# EAGLE design 25_UBX_test (EAGLE 9.0.0)
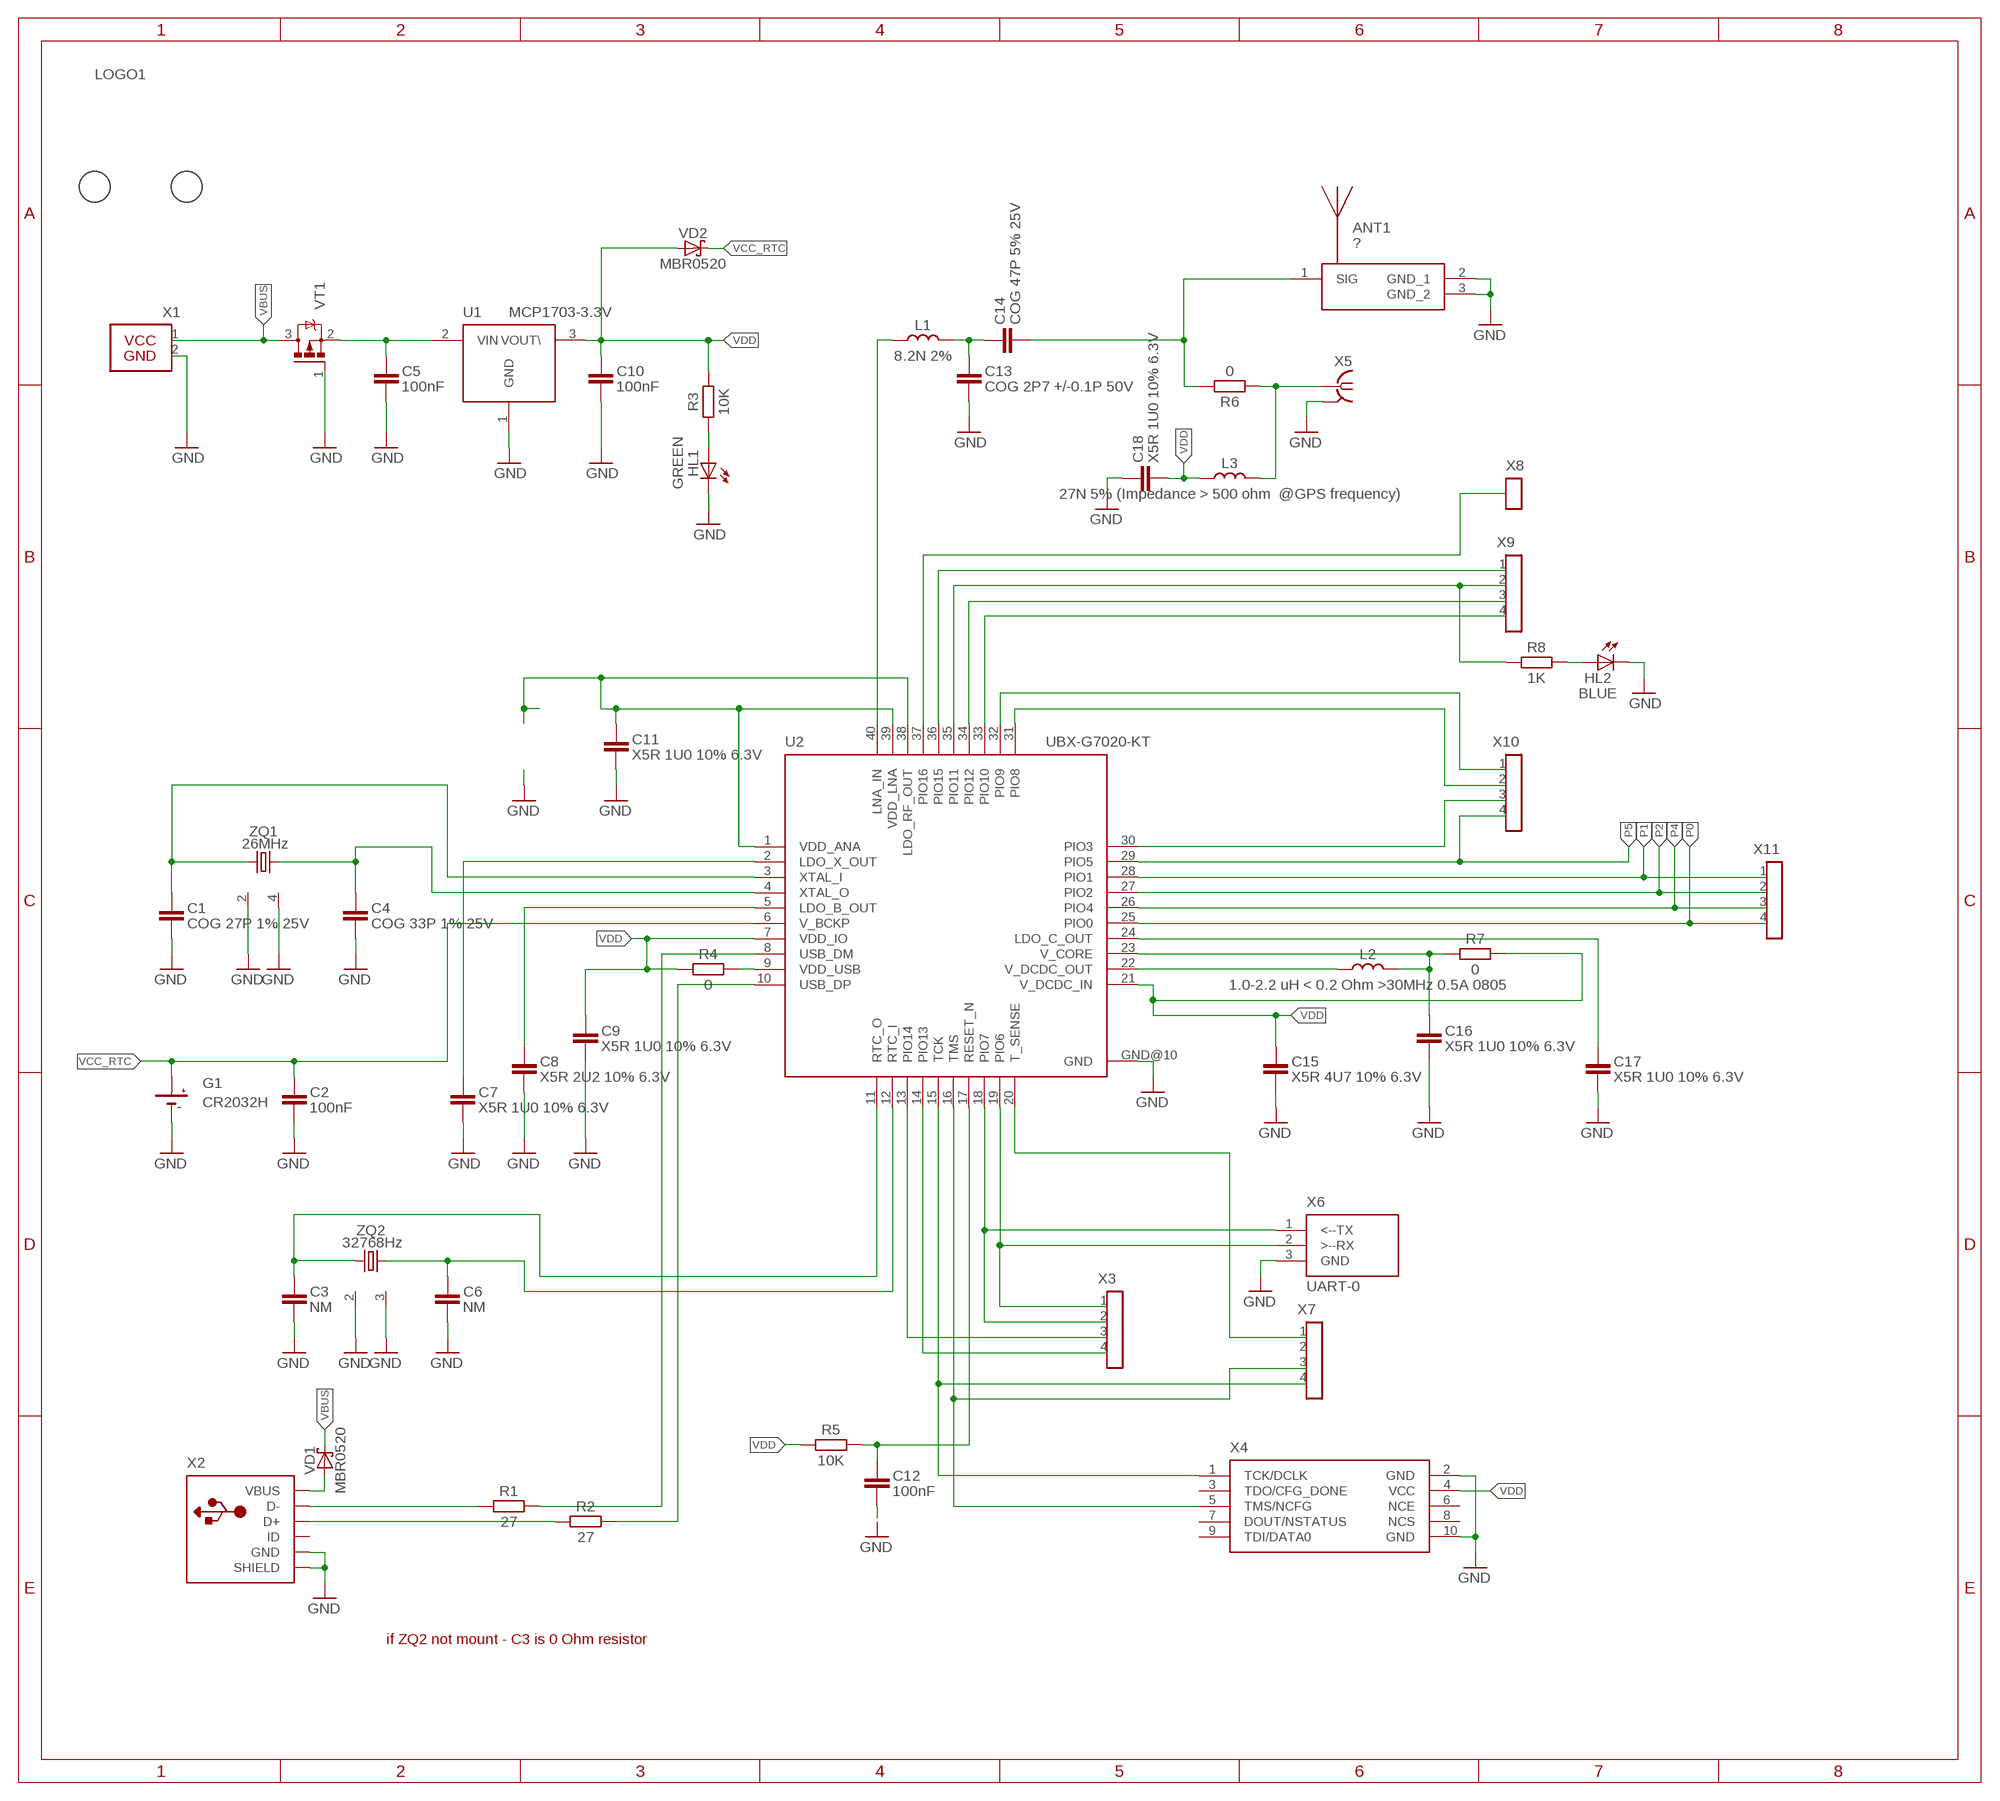
[diagram p0: schematic, sheet 1]

## Parts
ANT1  ?  ANT-GPS-3  [ANTENNA-GPS-AMAN1003030ST01]
C1  COG 27P 1% 25V  C-EU-C0603  [C0603]
C2  100nF  C-EU-C0603  [C0603]
C3  NM  C-EU-C0402  [C0402]
C4  COG 33P 1% 25V  C-EU-C0603  [C0603]
C5  100nF  C-EU-C0805  [C0805]
C6  NM  C-EU-C0402  [C0402]
C7  X5R 1U0 10% 6.3V  C-EU-C0603  [C0603]
C8  X5R 2U2 10% 6.3V  C-EU-C0603  [C0603]
C9  X5R 1U0 10% 6.3V  C-EU-C0603  [C0603]
C10  100nF  C-EU-C1206  [C1206]
C11  X5R 1U0 10% 6.3V  C-EU-C0603  [C0603]
C12  100nF  C-EU-C0603  [C0603]
C13  COG 2P7 +/-0.1P 50V  C-EU-C0603  [C0603]
C14  COG 47P 5% 25V  C-EU-C0603  [C0603]
C15  X5R 4U7 10% 6.3V  C-EU-C0603  [C0603]
C16  X5R 1U0 10% 6.3V  C-EU-C0603  [C0603]
C17  X5R 1U0 10% 6.3V  C-EU-C0603  [C0603]
C18  X5R 1U0 10% 6.3V  C-EU-C0603  [C0603]
FIDUCIAL1  FIDUCIAL-1MM  [FIDUCIAL_1MM]
FIDUCIAL2  FIDUCIAL-1MM  [FIDUCIAL_1MM]
G1  CR2032H  [SN2032]
HL1  GREEN  LED0805  [CHIPLED_0805]
HL2  BLUE  LED0805  [CHIPLED_0805]
L1  8.2N 2%  LL0603  [L0603-1]
L2  1.0-2.2 uH < 0.2 Ohm >30MHz 0.5A 0805  LL0805  [L0805]
L3  27N 5% (Impedance > 500 ohm @GPS frequency)  LL0603  [L0603-1]
LOGO1  LOGO6  [LOGO_OMEGA]
R1  27  R-EU0603  [R0603]
R2  27  R-EU0603  [R0603]
R3  10K  R-EU0603  [R0603]
R4  0  R-EU0805  [R0805]
R5  10K  R-EU0603  [R0603]
R6  0  R-EU0603  [R0603]
R7  0  R-EU0603  [R0603]
R8  1K  R-EU0603  [R0603]
U1  MCP1703-3.3V  MCP170XSOT89  [SOT89]
U2  UBX-G7020-KT  [QFN40-5X5]
VD1  MBR0520  SCHOTTKY-DIODE-SOD123  [SOD123]
VD2  MBR0520  SCHOTTKY-DIODE-SOD123  [SOD123]
VT1  FET_P-SOT23  [SOT23-3-1]
X1  CON-2P-1  [PLS-2.54-2]
X2  USB-5S-MINI  [USB-MINIB-1]
X3  CON-4PPLS2-4  [PLS2-4]
X4  JTAG-ALTERA-5X2PINHEAD  [ML10_NEW]
X5  U.FL-2  [U.FL.-4PIN]
X6  UART-0  [PLS-2.54-3]
X7  CON-4PPLS2-4  [PLS2-4]
X8  CON-1PPLS2-1  [PLS2-1]
X9  CON-4PPLS2-4  [PLS2-4]
X10  CON-4PPLS2-4  [PLS2-4]
X11  CON-4PPLS2-4  [PLS2-4]
ZQ1  26MHz  REZONATOR-4PIN-3225  [CRYSTAL-SMD-3225]
ZQ2  32768Hz  REZONATOR-4PIN-SJK-7M  [SJK-7M]

## Nets
ANT: ANT1.1(SIG) C14.2 R6.1
D_N: R1.1 U2.8(USB_DM)
D_P: R2.1 U2.10(USB_DP)
GND: ANT1.2(GND_1) ANT1.3(GND_2) C1.2 C2.2 C3.2 C4.2 C5.2 C6.2 C7.2 C8.2 C9.2 C10.2 C11.2 C12.2 C13.2 C15.2 C16.2 C17.2 C18.1 G1.-BATT(-) HL1.C HL2.C U1.1(GND) U2.GND@10(GND) VT1.1(G) X1.2 X2.GND X2.SHIELD@1(SHIELD) X2.SHIELD@2(SHIELD) X2.SHIELD@3(SHIELD) X2.SHIELD@4(SHIELD) X4.2(GND) X4.10(GND) X5.S@1(GND) X5.S@2(GND) X5.S@3(GND) X6.3(GND) ZQ1.2(S) ZQ1.4(S) ZQ2.2(S) ZQ2.3(S)
N$1: VD1.A X2.VBUS
N$2: L3.1(%1) R6.2 X5.1
N$4: HL1.A R3.1
N$5: C8.1 U2.5(LDO_B_OUT)
N$6: C17.1 U2.24(LDO_C_OUT)
N$7: L1.1(%1) U2.40(LNA_IN)
N$8: C13.1 C14.1 L1.2(%2)
N$9: R1.2 X2.D-
N$10: R2.2 X2.D+
N$12: C7.1 U2.2(LDO_X_OUT)
N$13: C11.1 U2.1(VDD_ANA) U2.38(LDO_RF_OUT) U2.39(VDD_LNA)
N$27: C5.1 U1.2(VIN) VT1.2(S)
N$32: HL2.A R8.2
N$37: R4.1 U2.9(VDD_USB)
N$38: L2.1(%1) U2.22(V_DCDC_OUT)
N$39: C16.1 L2.2(%2) R7.1 U2.23(V_CORE)
P0: U2.25(PIO0) X11.4
P1: U2.28(PIO1) X11.1
P2: U2.27(PIO2) X11.2
P3: U2.30(PIO3) X10.3
P4: U2.26(PIO4) X11.3
P5: U2.29(PIO5) X10.4
P6: U2.19(PIO6) X3.1 X6.2(>--RX)
P7: U2.18(PIO7) X3.2 X6.1(<--TX)
P8: U2.31(PIO8) X10.2
P9: U2.32(PIO9) X10.1
P10: U2.33(PIO10) X9.4
P11: R8.1 U2.35(PIO11) X9.2
P12: U2.34(PIO12) X9.3
P13: U2.14(PIO13) X3.4
P14: U2.13(PIO14) X3.3
P15: U2.36(PIO15) X9.1
P16: U2.37(PIO16) X8.1
RES: C12.1 R5.2 U2.17(RESET_N)
RTCI: C6.1 U2.12(RTC_I) ZQ2.4
RTCO: C3.1 U2.11(RTC_O) ZQ2.1
T_SENSE: U2.20(T_SENSE) X7.1
TCK: U2.15(TCK) X4.1(TCK/DCLK) X7.4
TMS: U2.16(TMS) X4.5(TMS/NCFG) X7.3
VBUS: VD1.C VT1.3(D) X1.1
VCC_RTC: C2.1 G1.+BATT(+) U2.6(V_BCKP) VD2.C
VDD: C9.1 C10.1 C15.1 C18.2 L3.2(%2) R3.2 R4.2 R5.1 R7.2 U1.3(VOUT\) U2.7(VDD_IO) U2.21(V_DCDC_IN) VD2.A X4.4(VCC)
XTALI: C1.1 U2.3(XTAL_I) ZQ1.1
XTALO: C4.1 U2.4(XTAL_O) ZQ1.3
Unconnected: X2.ID X4.3(TDO/CFG_DONE) X4.6(NCE) X4.7(DOUT/NSTATUS) X4.8(NCS) X4.9(TDI/DATA0) X7.2

## Notes on the sheet
- VCC
- GND
- if ZQ2 not mount - C3 is 0 Ohm resistor

## Library data of the parts
ANT1 = !ht3_misc:ANT-GPS-3
C1-C18 = !ht3_passive:C-EU: CAPACITOR, European symbol
FIDUCIAL1 FIDUCIAL2 = !ht3_misc:FIDUCIAL: For use by pick and place machines to calibrate the vision/machine, 1mm By microbuilder.eu
G1 = !ht3_misc:CR2032H: LI BATTERY Varta
HL1 HL2 = !ht3_leds:LED: LED OSRAM: - CHIPLED LG R971, LG N971, LY N971, LG Q971, LY Q971, LO R971, LY R971 LH N974, LH R974 LS Q976, LO Q976, LY Q976 LO Q996 - Hyper CHIPLED LW Q18S LB Q993, LB Q99A, LB R99A - SideLED LS A670, LO A670, LY A670, LG A670, LP A670 LB A673, LV A673, LT A673, LW A673 LH A674 LY A675 LS A676, LA A676, LO A676, LY A676, LW A676 LS A679, LY A679, LG A679 - Hyper Micro SIDELED® LS Y876, LA Y876, LO Y876, LY Y876 LT Y87S - SmartLED LW L88C, LW L88S LB L89C, LB L89S, LG L890 LS L89K, LO L89K, LY L89K LS L896, LA L896, LO L896, LY L896 - TOPLED LS T670, LO T670, LY T670, LG T670, LP T670 LSG T670, LSP T670, LSY T670, LOP T670, LYG T670 LG T671, LOG T671, LSG T671 LB T673, LV T673, LT T673, LW T673 LH T674 LS T676, LA T676, LO T676, LY T676, LB T676, LH T676, LSB T676, LW T676 LB T67C, LV T67C, LT T67C, LS T67K, LO T67K, LY T67K, LW E67C LS E67B, LA E67B, LO E67B, LY E67B, LB E67C, LV E67C, LT E67C LW T67C LS T679, LY T679, LG T679 LS T770, LO T770, LY T770, LG T770, LP T770 LB T773, LV T773, LT T773, LW T773 LH T774 LS E675, LA E675, LY E675, LS T675 LS T776, LA T776, LO T776, LY T776, LB T776 LHGB T686 LT T68C, LB T68C - Hyper Mini TOPLED® LB M676 - Mini TOPLED Santana® LG M470 LS M47K, LO M47K, LY M47K Source: http://www.osram.convergy.de LUXEON: - LUMILED® LXK2-PW12-R00, LXK2-PW12-S00, LXK2-PW14-U00, LXK2-PW14-V00 LXK2-PM12-R00, LXK2-PM12-S00, LXK2-PM14-U00 LXK2-PE12-Q00, LXK2-PE12-R00, LXK2-PE12-S00, LXK2-PE14-T00, LXK2-PE14-U00 LXK2-PB12-K00, LXK2-PB12-L00, LXK2-PB12-M00, LXK2-PB14-N00, LXK2-PB14-P00, LXK2-PB14-Q00 LXK2-PR12-L00, LXK2-PR12-M00, LXK2-PR14-Q00, LXK2-PR14-R00 LXK2-PD12-Q00, LXK2-PD12-R00, LXK2-PD12-S00 LXK2-PH12-R00, LXK2-PH12-S00 LXK2-PL12-P00, LXK2-PL12-Q00, LXK2-PL12-R00 Source: www.luxeon.com KINGBRIGHT: KA-3528ASYC Source: www.kingbright.com
L1-L3 = !ht3_inductor:L
LOGO1 = !ht3_misc:LOGO
R1-R8 = !ht3_passive:R-EU: RESISTOR, European symbol
U1 = !ht3_ic:MCP170X: http://ww1.microchip.com/downloads/en/DeviceDoc/20001826C.pdf Analog - XC6206
U2 = !ht3_ic:UBX-G7020
VD1 VD2 = !ht3_diode:SCHOTTKY-DIODE: Schottky Diode
VT1 = !ht3_transistor:FET_P
X1 = !ht3_connectors:CON-2P
X2 = !ht3_connectors:USB-5S: USB Connectors USBMINIB - Surface Mount Female Mini-B USB Connector 4UConnector: 06564 By microbuilder.eu Thru-hole RA Female Mini-B USB Connector 4UConnector: 18732 By ladyada.net
X3 X7 X9-X11 = !ht3_connectors:CON-4P
X4 = !ht3_connectors:JTAG-ALTERA-5X2
X5 = !ht3_connectors:U.FL
X6 = !ht3_connectors:UART
X8 = !ht3_connectors:CON-1P
ZQ1 ZQ2 = !ht3_misc:REZONATOR-4PIN: CRYSTAL

## Board
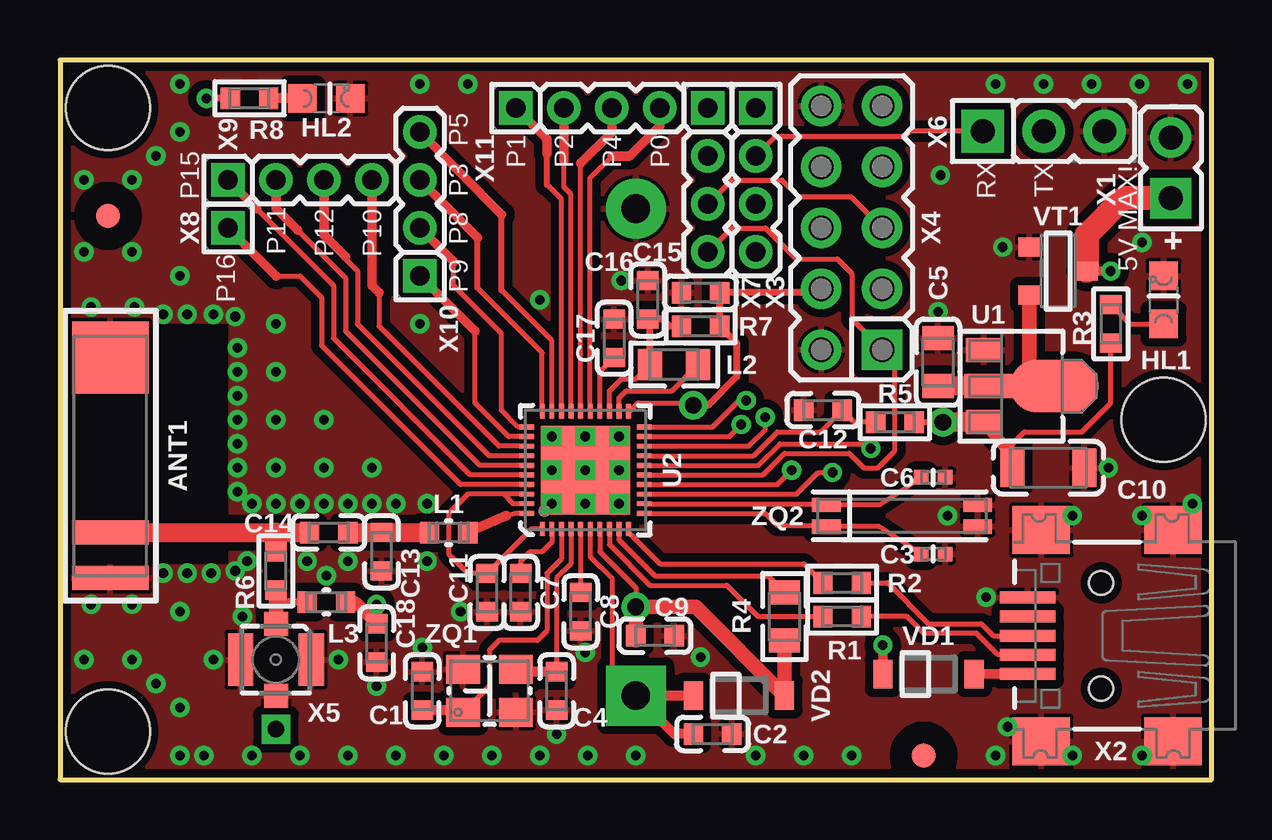
[diagram p1: board, top side]
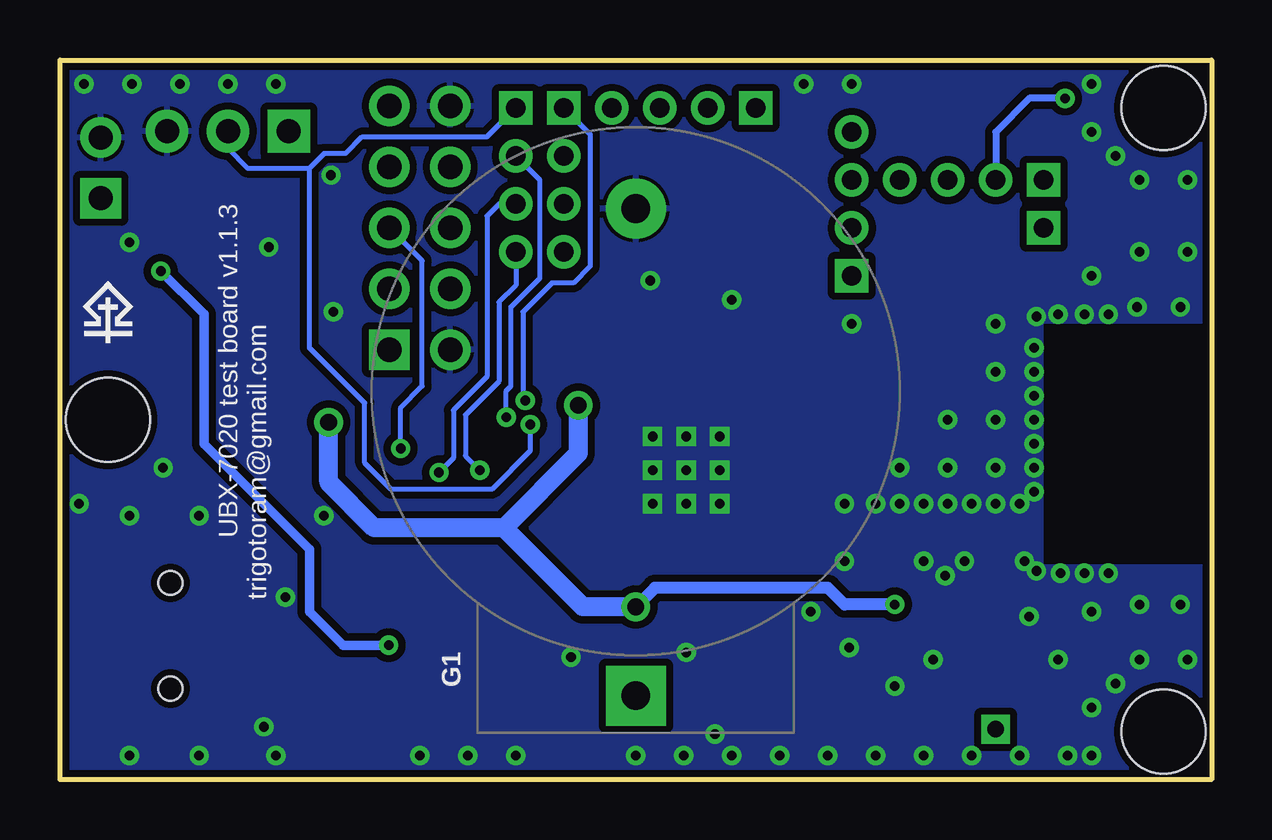
[diagram p2: board, bottom side, seen from below]

Size 48 x 30 mm. Coordinates in mm from the lower left corner, seen from the top.
Outline: 0,0 48,0 48,30 0,30 0,0
Copper layers (1*16): Top 0.035mm / dielectric 1.5mm / Bottom 0.035mm
Design rules "rules_MIN": minimum track width 0.2mm, minimum drill 0.4mm, track to track 0.18mm, track to pad 0.18mm, pad to pad 0.18mm, via to via 0.18mm, smd to smd 0.08mm, copper to edge 0.2mm, drill to drill 0.2mm, minimum pad ring 10mil, minimum via ring 8mil, stop-mask expansion 4mil, vias tented up to drill 0.6mm, thermal gap 0.15mm
Holes 3.5 mm at 2,2 2,28 46,15

### Footprints (pad centres in the part's own frame; a part is rotated, then mirrored left to right if it is on the bottom)
ANTENNA-GPS-AMAN1003030ST01 = smd 1 x 3.2: 1 -3.2,0; 2 -5.1,0 | smd 3 x 3.2: 3 4.1,0
C0603 = smd 0.8 x 0.9: 1 -0.8,0; 2 0.8,0
C0402 = smd 0.6 x 0.6: 1 -0.5,0; 2 0.5,0
C0805 = smd 1 x 1.3: 1 -1,0; 2 1,0
C1206 = smd 1 x 1.6: 1 -1.5,0; 2 1.5,0
FIDUCIAL_1MM = smd 1 x 1: 1 0,0
SN2032 = drill 1.2 pad 2.5 square: +BATT 0,20.3 | drill 1.2 pad 2.5: -BATT 0,0
CHIPLED_0805 = smd 1.2 x 1.2: A 0,-1; C 0,1
L0603-1 = smd 0.8 x 0.9: 1 -0.8,0; 2 0.8,0
L0805 = smd 1 x 1.3: 1 -1,0; 2 1,0
R0603 = smd 0.8 x 0.9: 1 -0.8,0; 2 0.8,0
R0805 = smd 1 x 1.3: 1 -1,0; 2 1,0
SOT89 = smd 1 x 1.5: 1 -1.5,-2; 3 1.5,-2 | smd 1 x 2: 2 0,-1.8 | smd 2.2 x 3.7: 2@1 0,0.94
QFN40-5X5 = smd 0.6 x 0.2: 1 -2.45,1.8; 2 -2.45,1.4; 3 -2.45,1; 4 -2.45,0.6; 5 -2.45,0.2; 6 -2.45,-0.2; 7 -2.45,-0.6; 8 -2.45,-1; 9 -2.45,-1.4; 10 -2.45,-1.8; 21 2.45,-1.8; 22 2.45,-1.4; 23 2.45,-1; 24 2.45,-0.6; 25 2.45,-0.2; 26 2.45,0.2; 27 2.45,0.6; 28 2.45,1; 29 2.45,1.4; 30 2.45,1.8 | smd 0.2 x 0.6: 11 -1.8,-2.45; 12 -1.4,-2.45; 13 -1,-2.45; 14 -0.6,-2.45; 15 -0.2,-2.45; 16 0.2,-2.45; 17 0.6,-2.45; 18 1,-2.45; 19 1.4,-2.45; 20 1.8,-2.45; 31 1.8,2.45; 32 1.4,2.45; 33 1,2.45; 34 0.6,2.45; 35 0.2,2.45; 36 -0.2,2.45; 37 -0.6,2.45; 38 -1,2.45; 39 -1.4,2.45; 40 -1.8,2.45 | smd 3.7 x 3.7: GND@10 0,0
SOD123 = smd 0.8 x 1.2: A 1.9,0; C -1.9,0
SOT23-3-1 = smd 0.8 x 0.9: 1 -1,-1.2; 2 1,-1.2; 3 0,1.2
PLS-2.54-2 = drill 1 pad 1.7 square: 1 -1.27,0 | drill 1 pad 1.7: 2 1.27,0
USB-MINIB-1 = smd 0.5 x 2.308: D+ 0,4.064; D- -0.8,4.064; GND 1.6,4.064; ID 0.8,4.064; VBUS -1.6,4.064 | smd 2 x 2.4: SHIELD@1 -4.4,-2; SHIELD@2 4.4,-2; SHIELD@3 4.4,3.5; SHIELD@4 -4.4,3.5 | hole 1: -2.2,1; 2.2,1
PLS2-4 = drill 0.8 pad 1.4 square: 1 0,0 | drill 0.8 pad 1.4: 2 2,0; 3 4,0; 4 6,0
ML10_NEW = drill 1.016 pad 1.676 square: 1 -5.08,-1.27 | drill 1.016 pad 1.676: 2 -5.08,1.27; 3 -2.54,-1.27; 4 -2.54,1.27; 5 0,-1.27; 6 0,1.27; 7 2.54,-1.27; 8 2.54,1.27; 9 5.08,-1.27; 10 5.08,1.27
U.FL.-4PIN = smd 1 x 1: 1 0,-1.5; S@1 0,1.5 | smd 1.05 x 2.2: S@2 -1.475,0; S@3 1.475,0
PLS-2.54-3 = drill 1 pad 1.778 square: 1 -2.54,0 | drill 1 pad 1.778: 2 0,0; 3 2.54,0
PLS2-1 = drill 0.8 pad 1.4 square: 1 0,0
CRYSTAL-SMD-3225 = smd 1.4 x 1.2: 1 -1.1,-0.9; 2 1.1,-0.9; 3 1.1,0.9; 4 -1.1,0.9
SJK-7M = smd 1.2 x 0.6: 1 -3.15,-0.45; 2 3.15,-0.45; 3 3.15,0.45; 4 -3.15,0.45

### Placement (x,y rotation side)
ANT1  2.1,13.5 90 top
C1  15.1,3.7 90 top
C2  27.2,1.9 0 top
C3  36.4,9.4 0 top
C4  20.7,3.7 270 top
C5  36.6,17.4 90 top
C6  36.4,12.6 0 top
C7  19.2,7.8 270 top
C8  21.7,7 270 top
C9  24.8,6 0 top
C10  41.2,13 0 top
C11  17.8,7.8 270 top
C12  31.8,15.4 180 top
C13  13.4,9.5 270 top
C14  11.2,10.3 180 top
C15  26.7,20.3 180 top
C16  24.5,20 90 top
C17  23.1,18.4 90 top
C18  13.2,5.7 90 top
FIDUCIAL1  2,23.5 0 top
FIDUCIAL2  36,1 0 top
G1  24,23.8 180 bottom
HL1  46,20 0 top
HL2  11.1,28.4 270 top
L1  16.2,10.3 180 top
L2  25.6,17.3 180 top
L3  11.1,7.4 0 top
LOGO1  46,19 0 bottom
R1  32.6,6.8 0 top
R2  32.6,8.2 0 top
R3  43.8,19 270 top
R4  30.2,6.8 270 top
R5  34.8,14.9 180 top
R6  9,8.7 270 top
R7  26.7,18.9 0 top
R8  7.9,28.4 0 top
U1  40.5,16.4 270 top
U2  21.9,12.9 90 top
VD1  36.2,4.4 0 top
VD2  28.3,3.5 0 top
VT1  41.6,21.2 270 top
X1  46.3,25.5 90 top
X2  44.4,6 90 top
X3  29,28 270 top
X4  33,23 90 top
X5  9,5 180 top
X6  41,27.03 0 top
X7  27,28 270 top
X8  7,23 0 top
X9  7,25 0 top
X10  15,21 90 top
X11  19,28 0 top
ZQ1  17.9,3.7 0 top
ZQ2  35.1,11 0 top

### Tracks (layer width: path | path; a pad name or v marks a point on that pad's centre or on a via)
ANT
  Top 0.8: ANT1.1 9,10.3 C14.2
  Top 0.813: R6.1 9,10.3
D_N
  Top 0.2: U2.8 22.9,9.8 24.6,8.1 27.8,8.1 29.1,6.8 R1.1
D_P
  Top 0.2: U2.10 23.7,10.3 25,9 31,9 R2.1
GND  (via drill 0.4 pad 0.8)
  other vias: 6.4,19.4 16.7,7 11.6,5 10,11.5 7.3,8.7 10.3,9.1 15.3,9.1 39.3,22.2 15.3,11.5 5.3,8.6 3,7.3 1.3,7.3 1.3,19.7 3.1,19.7 7.3,19.3 7.4,18 7.4,15 20.5,14.3 23.3,14.3 23.3,11.5 20.5,11.5 21.9,12.9 23.3,12.9 21.9,14.3 20.5,12.9 21.9,11.5 33,1 31,1 29,1 24,1 22,1 20,1 18,1 16,1 14,1 12,1 10,1 8,1 5,1 1,5 4,4 5,3 3,5 6,1 23.4,20.8 26.7,5.1 42.2,1 39.5,2.2 45.1,1 45.1,11 42.2,11 39,1 38.6,7.6 47.2,11.5 47,29 45,29 43,29 41,29 39,29 36.7,25.2 4,26 37,11 17,29 5,29 1,25 5,27 3,25 7.4,14 7.4,13 7.4,12 7.4,16 7.4,17 5.3,19.4 4.3,19.4 6.3,8.6 4.3,8.6 11.1,8.5 7.6,6.8 6.4,5 9,11.5 14,11.5 13,11.5 12,11.5 11,11.5 8,11.5 9,13 11,13 9,15 11,15 13,13 9,17 9,19 1,22 3,22 5,21 5,7 13.2,3.9 12,9.1 15.1,5.5 20.7,1.9 7.8,9.1 15,19 20,20 15,29 43.7,13 21.9,5.3 36.6,19.5 45.1,22.4
  pour Top (isolate 0.35): -3,-3 51,-3 51,33 -3,33
  pour Bottom (isolate 0.3): -2,-2 50,-2 50,32 -2,32
N$1
  Top 0.4: X2.VBUS VD1.A
N$2
  Top 0.3: L3.1 10,7.4 9.9,7.4 9,7.4
  Top 0.61: X5.1 9,7.4 R6.2
N$3
  cutout Top: 0,9 7,9 7,19 0,19
N$4
  Top 0.2: R3.1 44.6,19 HL1.A
N$5
  Top 0.2: U2.5 C8.1
N$6
  Top 0.2: U2.24 22.5,17 C17.1
N$7
  Top 0.2: U2.40 19,11.1 18.6,11
  Top 0.406: 18.6,11 L1.1
N$8
  Top 0.8: L1.2 C13.1 C14.1
N$9
  Top 0.2: X2.D- 39.1,5.2 38.2,6.1 36,6.1 35.3,6.8 R1.2
N$10
  Top 0.2: R2.2 34.5,8.2 36.2,6.5 38.4,6.5 38.9,6 X2.D+
N$12
  Top 0.2: U2.2 20.5,9.9 20.1,9.5 19.6,9.5 19.2,9.1 C7.1
N$13
  Top 0.2: U2.38 18.5,11.9 | 18.5,11.9 17,11.9 16.2,11.1 16.2,9.4 17,8.6 C11.1 19.65,10.45 U2.1 | U2.39 18.9,11.5 18.5,11.9
N$27
  Top 0.406: 40.4,17.4 40.4,17.3 39.5,16.4 U1.2
  Top 0.61: VT1.2 40.4,17.4
  Top 0.8: U1.2 C5.1
N$28
  cutout Bottom: 0,9 7,9 7,19 0,19
N$32
  Top 0.406: HL2.A R8.2
N$37
  Top 0.2: U2.9 23.3,10 24.8,8.5 29.5,8.5 R4.1
N$38
  Top 0.2: U2.22 23.3,15.9 23.6,16.2 25.5,16.2 L2.1
N$39
  Top 0.2: U2.23 22.9,16.2 23.4,16.7 24,16.7 L2.2
  Top 0.3: L2.2 24.6,19.1 C16.1 25.1,19.2 25.4,18.9 R7.1
N$40  (via drill 0.7 pad 1.2)
  other vias: 9,2.1
P0
  Top 0.2: U2.25 22.1,25.1 23,26
  Top 0.4: 23,26 23.73,26 25,27.27 X11.4
P1
  Top 0.2: U2.28 20.9,24.2 20.3,24.8
  Top 0.254: 20.3,24.8 20.3,26.1
  Top 0.4: X11.1 20.3,26.7 20.3,26.1
P2
  Top 0.2: U2.27 21.3,24.4 21,24.7 21,25.8
  Top 0.4: X11.2 21,25.8
P3
  Top 0.2: U2.30 20.1,17.8 17.4,20.5
  Top 0.254: 17.4,20.5 17.4,22.6
  Top 0.4: 17.4,22.6 X10.3
P4
  Top 0.2: U2.26 21.7,25.7
  Top 0.4: X11.3 23,27 21.7,25.7
P5
  Top 0.2: U2.29 20.5,18.3 18.4,20.4
  Top 0.254: 18.4,20.4 18.4,23.55
  Top 0.4: 18.4,23.55 X10.4
P6  (via drill 0.4 pad 0.8)
  Top 0.2: U2.19 27.9,14.3 v28.4,14.8
  Bottom 0.2: X3.1 30.2,26.8 35.4,26.8 36.1,26.1 37,26.1 37.6,25.5 | X6.2 41,26.3 40.2,25.5 37.6,25.5 | v28.4,14.8 28.4,13.7 30,12.1 34.2,12.1 35.3,13.2 35.3,15.7 37.6,18 37.6,25.5
P7  (via drill 0.4 pad 0.8)
  Top 0.2: U2.18 28.7,13.9 29.4,14.6 v29.4,15.1 | X6.1 35.43,27.03 35.2,26.8 29.8,26.8 X3.2
  Bottom 0.2: X3.2 28,25 28,20.9 29.2,19.7 29.2,16.4 29.4,16.2 v29.4,15.1
P8
  Top 0.2: U2.31 19.1,14.7 18.4,15.4 18.4,18.6 16.4,20.6 16.4,21.6
  Top 0.4: 16.4,21.6 X10.2
P9
  Top 0.2: U2.32 18.7,14.3 17.3,15.7 17.3,18.7
  Top 0.4: 17.3,18.7 X10.1
P10
  Top 0.2: U2.33 18.3,13.9 13.3,18.9 13.3,20.3
  Top 0.4: X9.4 13,20.6 13.3,20.3
P11  (via drill 0.4 pad 0.8)
  Top 0.2: U2.35 17.5,13.1 11.9,18.7 11.9,20.9 9.9,22.9
  Top 0.3: R8.1 v6.1,28.4
  Top 0.4: X9.2 9,23.8 9.9,22.9
  Bottom 0.3: v6.1,28.4 7.6,28.4 9,27 X9.2
P12
  Top 0.2: U2.34 17.9,13.5 12.4,19 12.4,21.2 11.9,21.7 11.9,21.8
  Top 0.4: X9.3 11,22.7 11.9,21.8
P13  (via drill 0.4 pad 0.8)
  Top 0.2: U2.14 29.9,12.3 v30.5,12.9
  Bottom 0.2: X3.4 29,20.6 29.7,19.9 29.7,16.6 31.1,15.2 31.1,13.5 v30.5,12.9
P14  (via drill 0.4 pad 0.8)
  Top 0.2: U2.13 30,11.9 30.3,11.9 30.7,11.9 31.6,12.8 v32.2,12.8
  Bottom 0.2: X3.3 29.7,24 30.2,23.5 30.2,16.8 31.6,15.4 31.6,13.4 v32.2,12.8
P15
  Top 0.2: U2.36 17.1,12.7 11.4,18.4 11.4,20.6 8.2,23.8
  Top 0.4: X9.1 8.2,23.8
P16
  Top 0.2: U2.37 16.7,12.3 10.9,18.1 10.9,20.1 10,21 9,21
  Top 0.4: X8.1 9,21
RES
  Top 0.2: U2.17 28.9,13.5 29.9,14.5 31.7,14.5 C12.1 33.1,14.9 R5.2
RTCI
  Top 0.2: U2.12 31.95,11.5 ZQ2.4 34.15,11.45 C6.1
RTCO
  Top 0.2: U2.11 29.4,11.1 29.9,10.6 31.9,10.6 ZQ2.1 34.15,10.55 C3.1
T_SENSE  (via drill 0.4 pad 0.8)
  Top 0.2: U2.20 27.2,14.7 28.3,15.8 v28.6,15.8
  Bottom 0.2: X7.1 25.9,26.9 25.9,21.4 26.6,20.7 27.5,20.7 28.7,19.5 28.7,15.9 v28.6,15.8
TCK
  Top 0.2: U2.15 29.3,12.7 30.2,13.6 32.9,13.6 33.5,13 34.1,13 34.8,13.7 34.8,17.39 X4.1 33,19.19 33,21.1 32.4,21.7 30.7,21.7 29.4,23 28,23 X7.4
TMS  (via drill 0.4 pad 0.8)
  Top 0.2: U2.16 29.1,13.1 30,14 33.6,14 v33.8,13.8 | X7.3 28,25 30.1,25 30.8,24.3 32.97,24.3 X4.5
  Bottom 0.2: v33.8,13.8 33.8,15.5 32.9,16.4 32.9,21.63 X4.5
VBUS  (via drill 0.4 pad 0.8)
  Top 0.4: VD1.C v34.3,5.6 | VT1.3 v43.8,21.2
  Top 1: X1.1 44.33,24.23 42.8,22.7 VT1.3
  Bottom 0.4: v34.3,5.6 36.2,5.6 37.6,7 37.6,9.6 42,14 42,19.4 v43.8,21.2
VCC_RTC
  Top 0.2: U2.6 22.1,9.3 23,8.4 23,4.5 G1.+BATT
  Top 0.406: VD2.C G1.+BATT 25.6,1.9 C2.1
VDD  (via drill 0.4 pad 0.8, 0.7 pad 1.2)
  Top 0.2: U2.7 22.5,9.5 24,8 v24,7.2 | U2.21 23.75,15.35 24.1,15.7 26,15.7 v26.4,15.6 | C10.1 39.7,14 40.2,14.5 42.6,14.5 43.8,15.7 R3.2
  Top 0.254: R5.1 v36.8,14.9
  Top 0.3: v26.4,15.6 27,15.6 28.2,16.8 28.2,18.2 R7.2 C15.1 31.57,20.3 X4.4
  Top 0.5: C10.1 39.7,13.5 U1.3 | L3.2 12.3,7.4 C18.2 v13.2,7.3
  Top 0.61: 24,5.8 C9.1 v24,7.2 26.5,7.2 VD2.A R4.2
  Top 0.813: v36.8,14.9 U1.3
  Bottom 0.5: v13.2,7.3 15.3,7.3 16,8 23.2,8 v24,7.2
  Bottom 0.8: v26.4,15.6 26.4,13.6 29.5,10.5 | 29.5,10.5 34.9,10.5 36.8,12.4 v36.8,14.9 | v24,7.2 26.2,7.2 29.5,10.5
XTALI
  Top 0.2: U2.3 20.9,9.2 20.3,8.6 20.3,6.2 19.9,5.8 18.3,5.8 17.9,5.4 17.9,3.9 ZQ1.1 16.4,2.9
  Top 0.406: C1.1 16.4,2.9
XTALO
  Top 0.2: 19,4.5 ZQ1.3 | U2.4 21.3,9 20.7,8.4 C4.1
  Top 0.406: C4.1 19,4.5

### Text on the board
tPlace: - | P5 | P1 | P2 | P4 | P0 | P15 | P3 | RX | TX | P11 | P12 | P10 | P8 | 5V MAX! | + | P16 | P9
bPlace: UBX-7020 test board v1.1.3 | trigotoram@gmail.com
Changes: restrict area 5.5 * 10